# Altium schematic sheet MCU.SchDoc: MCU
size A3; ApprovedBy: LD Stanton; Author: LD Stanton; CompanyName: University of Cape Town; DrawnBy: Lawrence Stanton; Engineer: Lawrence Stanton; Organization: University of Cape Town; Address1: Department of Electrical Engineering; Address2: Rondebosch; Address3: Cape Town; Address4: South Africa 7701; DocumentNumber: 11; SheetNumber: 11; SheetTotal: 20
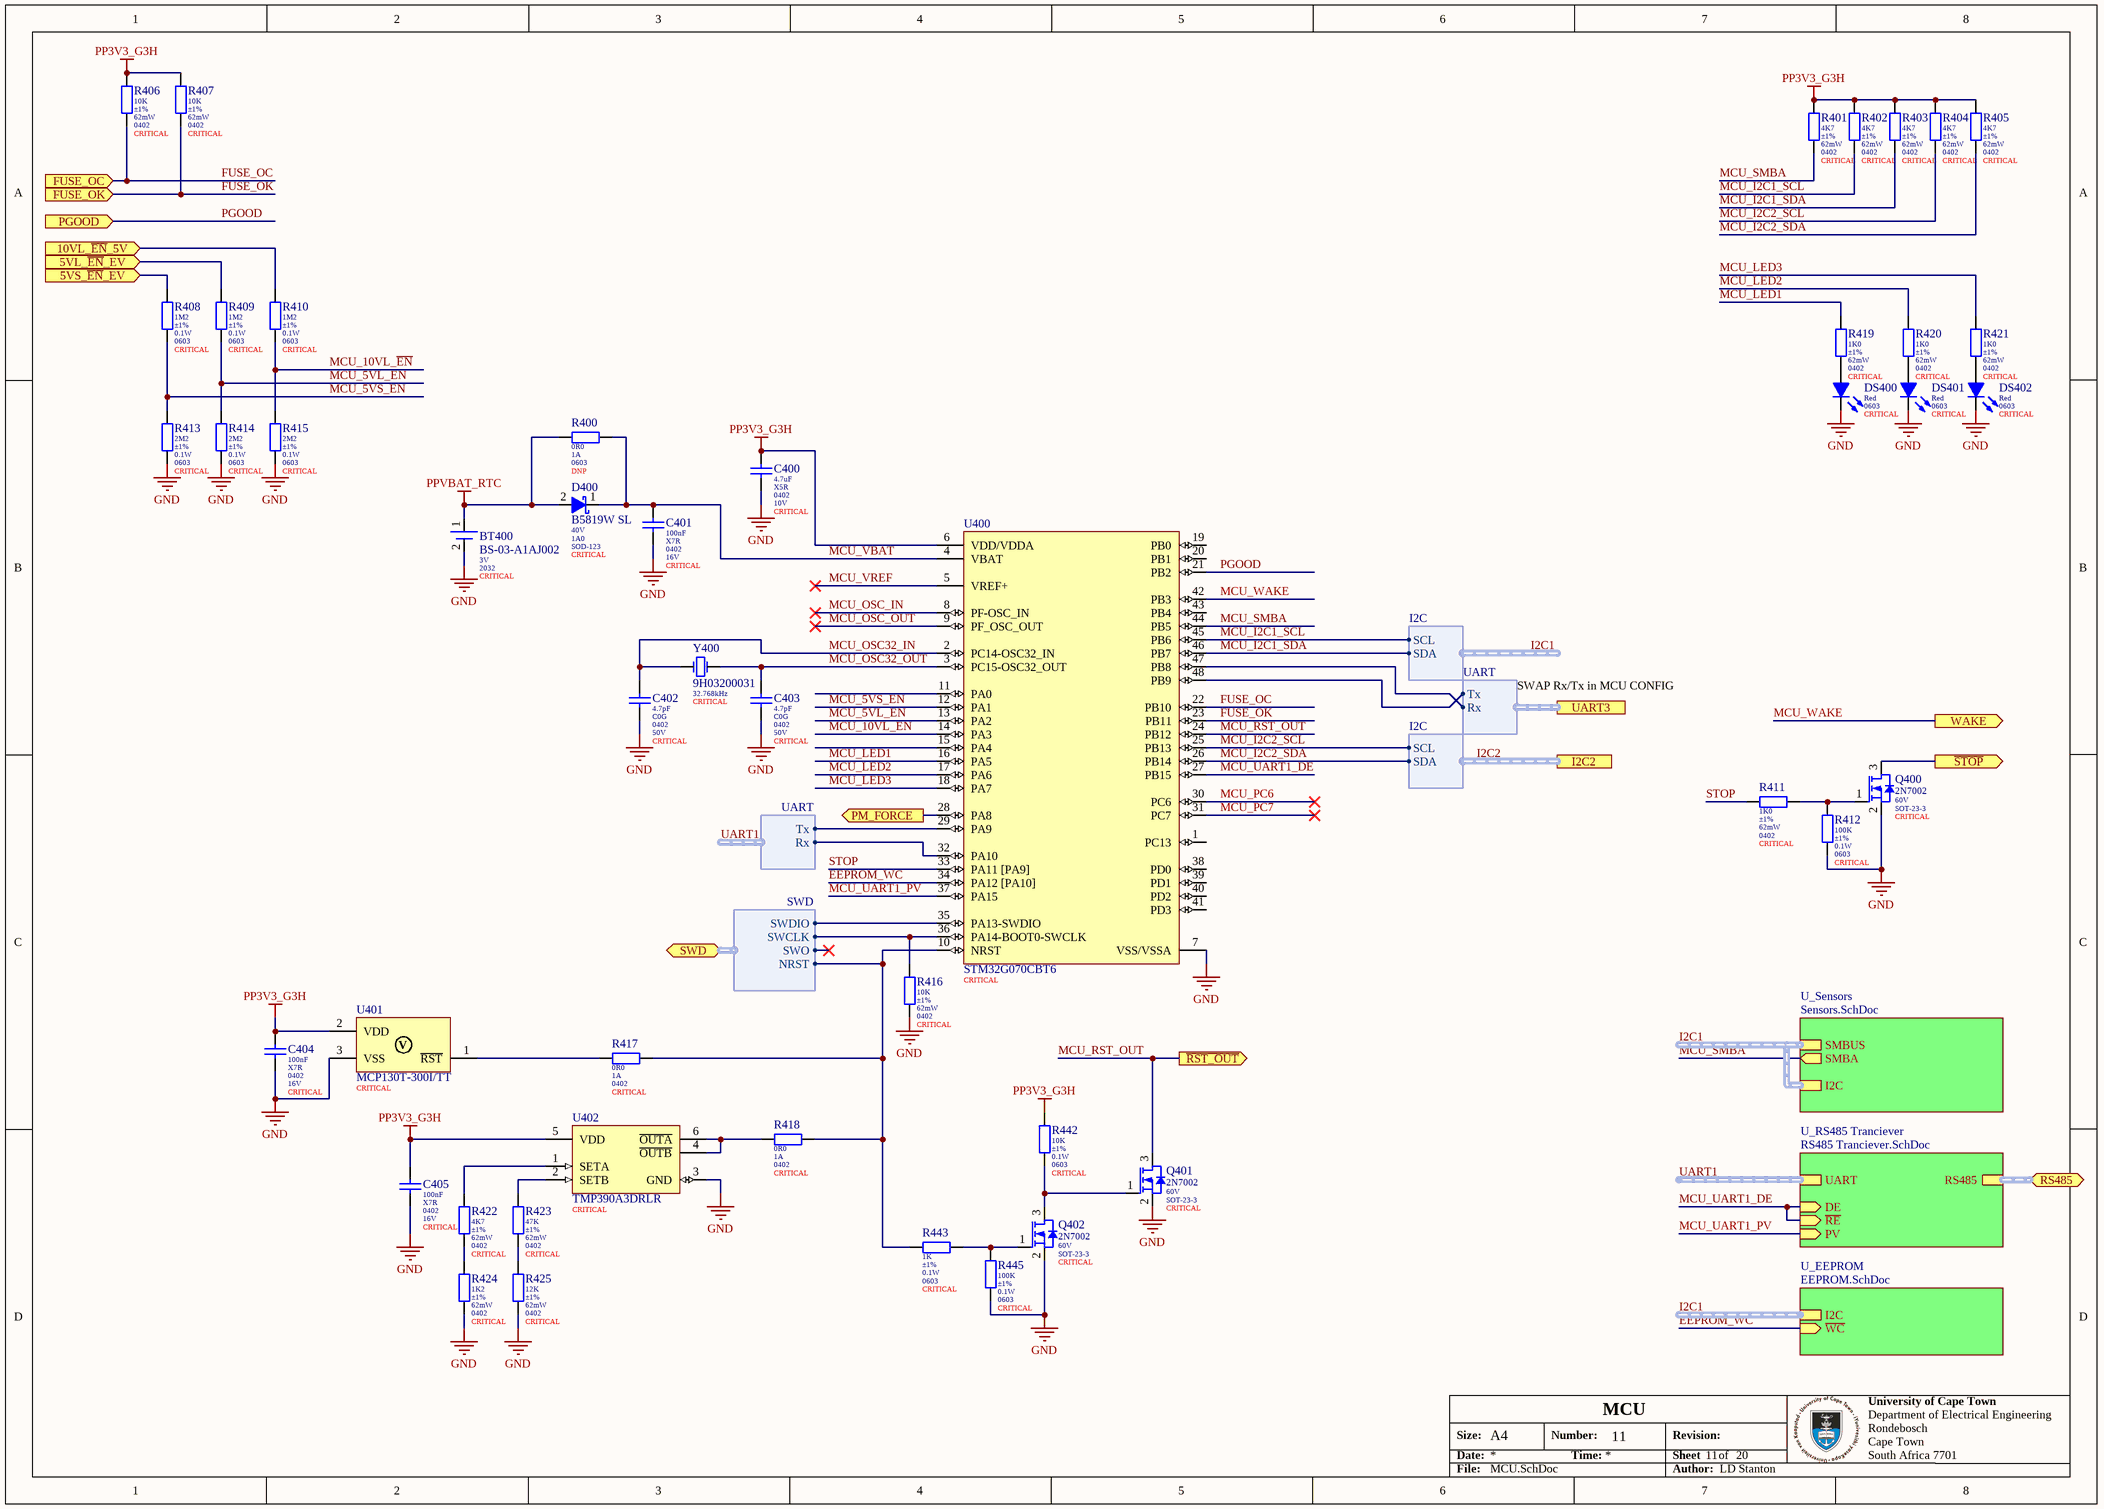
[diagram p0: MCU.SchDoc]

## Parts
BT400  BS-03-A1AJ002  value 3V  Package: 2032  Placement: CRITICAL  [BS-03-A1AJ002-Footprint-1]
C400  value 4.7uF  Dielectric: X5R  Package: 0402  Voltage: 10V  Populate: CRITICAL  [0402_050_5 (Samsumg) B]  (hidden comment: CL05A475MP5NRNC)
C401  value 100nF  Dielectric: X7R  Package: 0402  Voltage: 16V  Populate: CRITICAL  [0402_050_5 (Samsumg) B]  (hidden comment: CL05B104KO5NNNC)
C402  value 4.7pF  Dielectric: C0G  Package: 0402  Voltage: 50V  Populate: CRITICAL  [0402_050 (Guandong) B]  (hidden comment: 0402CG4R7C500NT)
C403  value 4.7pF  Dielectric: C0G  Package: 0402  Voltage: 50V  Populate: CRITICAL  [0402_050 (Guandong) B]  (hidden comment: 0402CG4R7C500NT)
C404  value 100nF  Dielectric: X7R  Package: 0402  Voltage: 16V  Populate: CRITICAL  [0402_050_5 (Samsumg) B]  (hidden comment: CL05B104KO5NNNC)
C405  value 100nF  Dielectric: X7R  Package: 0402  Voltage: 16V  Populate: CRITICAL  [0402_050_5 (Samsumg) B]  (hidden comment: CL05B104KO5NNNC)
D400  B5819W SL  Blocking Voltage: 40V  Forward Current: 1A0  Package: SOD-123  Placement: CRITICAL  [SOD-123 (JCET) B]
DS400  Colour: Red  Package: 0603  Placement: CRITICAL  [LED 0603 (Everlight) B]  (hidden comment: 19-217/R6C-AL1M2VY/3T)
DS401  Colour: Red  Package: 0603  Placement: CRITICAL  [LED 0603 (Everlight) B]  (hidden comment: 19-217/R6C-AL1M2VY/3T)
DS402  Colour: Red  Package: 0603  Placement: CRITICAL  [LED 0603 (Everlight) B]  (hidden comment: 19-217/R6C-AL1M2VY/3T)
Q400  2N7002  Maximum Drain Source Voltage: 60V  Package: SOT-23-3  Placement: CRITICAL  [SOT-23-3 (2N7002) B]
Q401  2N7002  Maximum Drain Source Voltage: 60V  Package: SOT-23-3  Placement: CRITICAL  [SOT-23-3 (2N7002) B]
Q402  2N7002  Maximum Drain Source Voltage: 60V  Package: SOT-23-3  Placement: CRITICAL  [SOT-23-3 (2N7002) B]
R400  value 0R0  Current: 1A  Package: 0603  Populate: DNP  [0603 (Uniroyal) B]  (hidden comment: 0603WAF0000T5E)
R401  value 4K7  Tolerance: ±1%  Power: 62mW  Package: 0402  Populate: CRITICAL  [0402 (Uniroyal) B]  (hidden comment: 0402WGF4701TCE)
R402  value 4K7  Tolerance: ±1%  Power: 62mW  Package: 0402  Populate: CRITICAL  [0402 (Uniroyal) B]  (hidden comment: 0402WGF4701TCE)
R403  value 4K7  Tolerance: ±1%  Power: 62mW  Package: 0402  Populate: CRITICAL  [0402 (Uniroyal) B]  (hidden comment: 0402WGF4701TCE)
R404  value 4K7  Tolerance: ±1%  Power: 62mW  Package: 0402  Populate: CRITICAL  [0402 (Uniroyal) B]  (hidden comment: 0402WGF4701TCE)
R405  value 4K7  Tolerance: ±1%  Power: 62mW  Package: 0402  Populate: CRITICAL  [0402 (Uniroyal) B]  (hidden comment: 0402WGF4701TCE)
R406  value 10K  Tolerance: ±1%  Power: 62mW  Package: 0402  Populate: CRITICAL  [0402 (Uniroyal) B]  (hidden comment: 0402WGF1002TCE)
R407  value 10K  Tolerance: ±1%  Power: 62mW  Package: 0402  Populate: CRITICAL  [0402 (Uniroyal) B]  (hidden comment: 0402WGF1002TCE)
R408  value 1M2  Tolerance: ±1%  Power: 0.1W  Package: 0603  Populate: CRITICAL  [0603 (Uniroyal) B]  (hidden comment: 0603WAF1204T5E)
R409  value 1M2  Tolerance: ±1%  Power: 0.1W  Package: 0603  Populate: CRITICAL  [0603 (Uniroyal) B]  (hidden comment: 0603WAF1204T5E)
R410  value 1M2  Tolerance: ±1%  Power: 0.1W  Package: 0603  Populate: CRITICAL  [0603 (Uniroyal) B]  (hidden comment: 0603WAF1204T5E)
R411  value 1K0  Tolerance: ±1%  Power: 62mW  Package: 0402  Populate: CRITICAL  [0402 (Uniroyal) B]  (hidden comment: 0402WGF1001TCE)
R412  value 100K  Tolerance: ±1%  Power: 0.1W  Package: 0603  Populate: CRITICAL  [0603 (Uniroyal) B]  (hidden comment: 0603WAF1003T5E)
R413  value 2M2  Tolerance: ±1%  Power: 0.1W  Package: 0603  Populate: CRITICAL  [0603 (Uniroyal) B]  (hidden comment: 0603WAF2204T5E)
R414  value 2M2  Tolerance: ±1%  Power: 0.1W  Package: 0603  Populate: CRITICAL  [0603 (Uniroyal) B]  (hidden comment: 0603WAF2204T5E)
R415  value 2M2  Tolerance: ±1%  Power: 0.1W  Package: 0603  Populate: CRITICAL  [0603 (Uniroyal) B]  (hidden comment: 0603WAF2204T5E)
R416  value 10K  Tolerance: ±1%  Power: 62mW  Package: 0402  Populate: CRITICAL  [0402 (Uniroyal) B]  (hidden comment: 0402WGF1002TCE)
R417  value 0R0  Current: 1A  Package: 0402  Populate: CRITICAL  [0402 (Uniroyal) B]  (hidden comment: 0402WGF0000TCE)
R418  value 0R0  Current: 1A  Package: 0402  Populate: CRITICAL  [0402 (Uniroyal) B]  (hidden comment: 0402WGF0000TCE)
R419  value 1K0  Tolerance: ±1%  Power: 62mW  Package: 0402  Populate: CRITICAL  [0402 (Uniroyal) B]  (hidden comment: 0402WGF1001TCE)
R420  value 1K0  Tolerance: ±1%  Power: 62mW  Package: 0402  Populate: CRITICAL  [0402 (Uniroyal) B]  (hidden comment: 0402WGF1001TCE)
R421  value 1K0  Tolerance: ±1%  Power: 62mW  Package: 0402  Populate: CRITICAL  [0402 (Uniroyal) B]  (hidden comment: 0402WGF1001TCE)
R422  value 4K7  Tolerance: ±1%  Power: 62mW  Package: 0402  Populate: CRITICAL  [0402 (Uniroyal) B]  (hidden comment: 0402WGF4701TCE)
R423  value 47K  Tolerance: ±1%  Power: 62mW  Package: 0402  Populate: CRITICAL  [0402 (Uniroyal) B]  (hidden comment: 0402WGF4702TCE)
R424  value 1K2  Tolerance: ±1%  Power: 62mW  Package: 0402  Populate: CRITICAL  [0402 (Uniroyal) B]  (hidden comment: 0402WGF1201TCE)
R425  value 12K  Tolerance: ±1%  Power: 62mW  Package: 0402  Populate: CRITICAL  [0402 (Uniroyal) B]  (hidden comment: 0402WGF1202TCE)
R442  value 10K  Tolerance: ±1%  Power: 0.1W  Package: 0603  Populate: CRITICAL  [0603 (Uniroyal) B]  (hidden comment: 0603WAF1002T5E)
R443  value 1K  Tolerance: ±1%  Power: 0.1W  Package: 0603  Populate: CRITICAL  [0603 (Uniroyal) B]  (hidden comment: 0603WAF1001T5E)
R445  value 100K  Tolerance: ±1%  Power: 0.1W  Package: 0603  Populate: CRITICAL  [0603 (Uniroyal) B]  (hidden comment: 0603WAF1003T5E)
U400  STM32G070CBT6  Placement: CRITICAL  [LQFP48 (STM32G0) B]
U401  MCP130T-300I/TT  Placement: CRITICAL  [SOT23-3 (MCP120) B]
U402  TMP390A3DRLR  Placement: CRITICAL  [SOT56-3 (DRL0006A) B]
Y400  9H03200031  Frequency: 32.768kHz  Placement: CRITICAL  [Crystal 3215 (TXC) B]

## Sub-sheets
U_EEPROM = EEPROM.SchDoc: I2C (harness I2C), ~{WC} (in)
U_RS485 Tranciever = RS485 Tranciever.SchDoc: RS485 (harness RS485), UART (harness UART), DE (in), ~{RE} (in), PV (in)
U_Sensors = Sensors.SchDoc: SMBUS (harness I2C), SMBA (out), I2C (harness I2C)

## Ports
5VL_~{EN}_EV (in), 5VS_~{EN}_EV (in), 10VL_~{EN}_5V (in), FUSE_OC (in), FUSE_OK (in), I2C2 (harness I2C), PGOOD (in), PM_FORCE (out), RS485 (bidir, harness RS485), SWD (bidir, harness SWD), UART3 (harness UART), WAKE (out), ~{RST_OUT} (out), ~{STOP} (out)

## Harnesses
I2C: SCL, SDA
SWD: SWCLK, SWDIO, NRST, SWO
UART: Rx, Tx

## Nets
GND: BT400.2 C400.2 C401.2 C402.2 C403.2 C404.2 C405.2 DS400.K DS401.K DS402.K Q400.2(S) Q401.2(S) Q402.2(S) R412.2 R413.2 R414.2 R415.2 R416.2 R424.2 R425.2 R445.2 U400.7(VSS/VSSA) U401.3(VSS) U402.3(GND)
PP3V3_G3H: C400.1 C404.1 C405.1 R401.1 R402.1 R403.1 R404.1 R405.1 R406.1 R407.1 R442.1 U400.6(VDD/VDDA) U401.2(VDD) U402.5(VDD)
PPVBAT_RTC: BT400.1 D400.2(A) R400.1
5VL_~{EN}_EV: R409.2 ; port 5VL_~{EN}_EV
5VS_~{EN}_EV: R408.2 ; port 5VS_~{EN}_EV
10VL_~{EN}_5V: R410.2 ; port 10VL_~{EN}_5V
~{EEPROM_WC}: U400.34(PA12_[PA10]) ; sheet U_EEPROM/~{WC}
~{STOP}: Q400.3(D) ; port ~{STOP}
FUSE_OC: R406.2 U400.22(PB10) ; port FUSE_OC
FUSE_OK: R407.2 U400.23(PB11) ; port FUSE_OK
MCU_5VL_~{EN}: R409.1 R414.1 U400.13(PA2)
MCU_5VS_~{EN}: R408.1 R413.1 U400.12(PA1)
MCU_10VL_~{EN}: R410.1 R415.1 U400.14(PA3)
MCU_I2C1_SCL: R402.2 U400.45(PB6) ; sheet U_EEPROM/I2C.SCL  [project net I2C1.SCL]
MCU_I2C1_SDA: R403.2 U400.46(PB7) ; sheet U_EEPROM/I2C.SDA  [project net I2C1.SDA]
MCU_I2C2_SCL: R404.2 U400.25(PB13) ; port I2C2.SCL  [project net I2C2.SCL]
MCU_I2C2_SDA: R405.2 U400.26(PB14) ; port I2C2.SDA  [project net I2C2.SDA]
MCU_LED1: R419.1 U400.16(PA5)
MCU_LED2: R420.1 U400.17(PA6)
MCU_LED3: R421.1 U400.18(PA7)
MCU_OSC32_IN: C402.1 U400.2(PC14-OSC32_IN) Y400.1
MCU_OSC32_OUT: C403.1 U400.3(PC15-OSC32_OUT) Y400.2
MCU_OSC_IN: U400.8(PF-OSC_IN)
MCU_OSC_OUT: U400.9(PF_OSC_OUT)
MCU_PC6: U400.30(PC6)
MCU_PC7: U400.31(PC7)
MCU_RST_OUT: Q401.3(D) U400.24(PB12) ; port ~{RST_OUT}
MCU_SMBA: R401.2 U400.44(PB5) ; sheet U_Sensors/SMBA
MCU_UART1_DE: U400.27(PB15) ; sheet U_RS485 Tranciever/DE, sheet U_RS485 Tranciever/~{RE}
MCU_UART1_PV: U400.37(PA15) ; sheet U_RS485 Tranciever/PV
MCU_VBAT: C401.1 D400.1(K) R400.2 U400.4(VBAT)
MCU_VREF: U400.5(VREF+)
MCU_WAKE: U400.42(PB3) ; port WAKE
PGOOD: U400.21(PB2) ; port PGOOD
PM_FORCE: U400.28(PA8) ; port PM_FORCE
STOP: R411.1 U400.33(PA11_[PA9])
UART1.Rx: U400.32(PA10) ; sheet U_RS485 Tranciever/UART.Rx
UART1.Tx: U400.29(PA9) ; sheet U_RS485 Tranciever/UART.Tx
NetDS400_A: DS400.A R419.2
NetDS401_A: DS401.A R420.2
NetDS402_A: DS402.A R421.2
NetQ400_1: Q400.1(G) R411.2 R412.1
NetQ401_1: Q401.1(G) Q402.3(D) R442.2
NetQ402_1: Q402.1(G) R443.2 R445.1
NetR416_1: R416.1 U400.36(PA14-BOOT0-SWCLK) ; port SWD.SWCLK
NetR417_1: R417.1 U401.1(~{RST})
NetR417_2: R417.2 R418.2 R443.1 U400.10(NRST) ; port SWD.NRST
NetR418_1: R418.1 U402.4(~{OUTB}) U402.6(~{OUTA})
NetR422_1: R422.1 U402.1(SETA)
NetR422_2: R422.2 R424.1
NetR423_1: R423.1 U402.2(SETB)
NetR423_2: R423.2 R425.1
NetU400_35: U400.35(PA13-SWDIO) ; port SWD.SWDIO
NetU400_47: U400.47(PB8) ; port UART3.Rx
NetU400_48: U400.48(PB9) ; port UART3.Tx

Not connected (* = marked no-connect by the designer): U400 1(PC13) 11(PA0) 15(PA4) 19(PB0) 20(PB1) 38(PD0) 39(PD1) 40(PD2) 41(PD3) 43(PB4)

## Buses and harness runs
harness I2C1 = sheet U_EEPROM/I2C
harness I2C1 = sheet U_Sensors/I2C = sheet U_Sensors/SMBUS
harness I2C2 = port I2C2
harness port RS485 = sheet U_RS485 Tranciever/RS485
harness UART1 = sheet U_RS485 Tranciever/UART

## Notes on the sheet
- SWAP Rx/Tx in MCU CONFIG
- Size:
- Date:
- A4
- Number:
- Time:
- Revision:
- Sheet
- of
- File:
- Author:
- (in symbol CMP-000036-4) V

## Library data of the parts
BT400 = CMP-002-00001-3: Coin Cell Battery Holder 2032; LCSC Part Number: C964748; ComponentLink1Description: Drawing; ComponentLink1URL: https://datasheet.lcsc.com/lcsc/2012181808_MYOUNG-BS-03-A1AJ002_C964748.pdf
C400 = CMP-045-000019-8: MLCC 4.7uF 0402 10V X5R ±20%; Manufacturer: Samsung; ComponentLink1URL: https://datasheet.lcsc.com/szlcsc/Samsung-Electro-Mechanics-CL05C100JB5NNNC_C32949.pdf; Tolerance: ±20%; LCSC Part Number: C23733; ComponentLink1Description: Datasheet
C401 C404 C405 = CMP-045-000014-12: MLCC 100nF 0402 16V X7R ±10%; Manufacturer: Samsung; ComponentLink1Description: Datasheet; ComponentLink1URL: https://datasheet.lcsc.com/szlcsc/Samsung-Electro-Mechanics-CL05C100JB5NNNC_C32949.pdf; LCSC Part Number: C1525; Tolerance: ±10%
C402 C403 = CMP-014-000013-1: MLCC 4.7pF 0402 50V C0G ±0.25pF; Manufacturer: Guandong; ComponentLink1URL: https://datasheet.lcsc.com/szlcsc/Guangdong-Fenghua-Advanced-Tech-0402B102K500NT_C1523.pdf; ComponentLink1Description: Datasheet; LCSC Part Number: C1569; Tolerance: ±0.25pF
D400 = CMP-022-000009-2: Schottky Barrier Diode 40V 1A 600mV SOD-123 JCET; ComponentLink1URL: https://datasheet.lcsc.com/lcsc/1809140216_Changjiang-Electronics-Tech--CJ-B5819W-SL_C8598.pdf; LCSC Part Number: C8598; ComponentLink1Description: Datasheet
DS400-DS402 = CMP-007-00000-1: LED 0603 SMT Red; Manufacturer: Everlight; Maximum Forward Current: 20mA; Forward Voltage: 2.2V; ComponentLink1Description: Datasheet; RoHS Compliant: Yes; ComponentLink1URL: https://datasheet.lcsc.com/lcsc/1811101510_Everlight-Elec-19-217-R6C-AL1M2VY-3T_C72044.pdf; LCSC Part Number: C72044
Q400-Q402 = CMP-040-000000-14: Small Signal MOSFET, 500 mA, 60 V, N-Channel, Enhancement, JCET SOT-23-3; Gate Threshold Voltage: 2V5; Power: 0.225W; Maximum Drain Current: 0.2A; Maximum Gate Source Voltage: ±20V; Drain-Source On Resistance: 7R; ComponentLink1Description: Datasheet; LCSC Part Number: C8545; ComponentLink1URL: https://datasheet.lcsc.com/szlcsc/Changjiang-Electronics-Tech-CJ-2N7002_C8545.pdf; Manufacturer: JCET
R400 = CMP-010-000359-7: Jumper 0603 1A Uniroyal; Pin Count: 2; ComponentLink1URL: https://datasheet.lcsc.com/szlcsc/1811062009_UNI-ROYAL-Uniroyal-Elec-0603WAF1002T5E_C25804.pdf; Manufacturer: Uniroyal; LCSC Part Number: C21189; Temperature: -55 - 155°C; ComponentLink1Description: Datasheet
R401-R405 R422 = CMP-010-000338-12: Resistor 4K7 0402 ±1% Thick Film Uniroyal; Temperature Coefficient: ±100ppm/K; Working Voltage: 50V; Temperature: -55 - 155°C; ComponentLink1URL: https://datasheet.lcsc.com/szlcsc/1811062009_UNI-ROYAL-Uniroyal-Elec-0603WAF1002T5E_C25804.pdf; Manufacturer: Uniroyal; LCSC Part Number: C25900; Pin Count: 2; ComponentLink1Description: Datasheet
R406 R407 R416 = CMP-010-000292-12: Resistor 10K 0402 ±1% Thick Film Uniroyal; Working Voltage: 50V; Temperature Coefficient: ±100ppm/K; Manufacturer: Uniroyal; Pin Count: 2; ComponentLink1URL: https://datasheet.lcsc.com/szlcsc/1811062009_UNI-ROYAL-Uniroyal-Elec-0603WAF1002T5E_C25804.pdf; LCSC Part Number: C25744; Temperature: -55 - 155°C; ComponentLink1Description: Datasheet
R408-R410 = CMP-010-000374-4: Resistor 1M2 0603 ±1% Thick Film Uniroyal; Temperature Coefficient: ±100ppm/K; Working Voltage: 75V; Temperature: -55 - 155°C; Pin Count: 2; ComponentLink1URL: https://datasheet.lcsc.com/szlcsc/1811062009_UNI-ROYAL-Uniroyal-Elec-0603WAF1002T5E_C25804.pdf; Manufacturer: Uniroyal; LCSC Part Number: C13315; ComponentLink1Description: Datasheet
R411 R419-R421 = CMP-010-000307-13: Resistor 1K0 0402 ±1% Thick Film Uniroyal; Working Voltage: 50V; Temperature Coefficient: ±100ppm/K; Temperature: -55 - 155°C; ComponentLink1URL: https://datasheet.lcsc.com/szlcsc/1811062009_UNI-ROYAL-Uniroyal-Elec-0603WAF1002T5E_C25804.pdf; Manufacturer: Uniroyal; Pin Count: 2; ComponentLink1Description: Datasheet; LCSC Part Number: C11702
R412 R445 = CMP-010-000288-10: Resistor 100K 0603 ±1% Thick Film Uniroyal; Working Voltage: 75V; Temperature Coefficient: ±100ppm/K; Manufacturer: Uniroyal; ComponentLink1URL: https://datasheet.lcsc.com/szlcsc/1811062009_UNI-ROYAL-Uniroyal-Elec-0603WAF1002T5E_C25804.pdf; LCSC Part Number: C25803; Temperature: -55 - 155°C; ComponentLink1Description: Datasheet; Pin Count: 2
R413-R415 = CMP-010-000383-2: Resistor 2M2 0603 ±1% Thick Film Uniroyal; Temperature Coefficient: ±100ppm/K; Working Voltage: 75V; Temperature: -55 - 155°C; Manufacturer: Uniroyal; Pin Count: 2; LCSC Part Number: C22938; ComponentLink1URL: https://datasheet.lcsc.com/szlcsc/1811062009_UNI-ROYAL-Uniroyal-Elec-0603WAF1002T5E_C25804.pdf; ComponentLink1Description: Datasheet
R417 R418 = CMP-010-000280-15: Jumper 0402 1A Uniroyal; Working Voltage: 50V; ComponentLink1URL: https://datasheet.lcsc.com/szlcsc/1811062009_UNI-ROYAL-Uniroyal-Elec-0603WAF1002T5E_C25804.pdf; Manufacturer: Uniroyal; ComponentLink1Description: Datasheet; LCSC Part Number: C17168; Pin Count: 2; Temperature: -55 - 155°C
R423 = CMP-010-000337-13: Resistor 47K 0402 ±1% Thick Film Uniroyal; Temperature Coefficient: ±100ppm/K; Working Voltage: 50V; Temperature: -55 - 155°C; ComponentLink1Description: Datasheet; Pin Count: 2; Manufacturer: Uniroyal; ComponentLink1URL: https://datasheet.lcsc.com/szlcsc/1811062009_UNI-ROYAL-Uniroyal-Elec-0603WAF1002T5E_C25804.pdf; LCSC Part Number: C25792
R424 = CMP-010-000309-12: Resistor 1K2 0402 ±1% Thick Film Uniroyal; Temperature Coefficient: ±100ppm/K; Working Voltage: 50V; ComponentLink1Description: Datasheet; LCSC Part Number: C25862; ComponentLink1URL: https://datasheet.lcsc.com/szlcsc/1811062009_UNI-ROYAL-Uniroyal-Elec-0603WAF1002T5E_C25804.pdf; Temperature: -55 - 155°C; Pin Count: 2; Manufacturer: Uniroyal
R425 = CMP-010-000301-12: Resistor 12K 0402 ±1% Thick Film Uniroyal; Temperature Coefficient: ±100ppm/K; Working Voltage: 50V; ComponentLink1URL: https://datasheet.lcsc.com/szlcsc/1811062009_UNI-ROYAL-Uniroyal-Elec-0603WAF1002T5E_C25804.pdf; LCSC Part Number: C25752; Pin Count: 2; Manufacturer: Uniroyal; ComponentLink1Description: Datasheet; Temperature: -55 - 155°C
R442 = CMP-010-000293-9: Resistor 10K 0603 ±1% Thick Film Uniroyal; Temperature Coefficient: ±100ppm/K; Working Voltage: 75V; Manufacturer: Uniroyal; LCSC Part Number: C25804; ComponentLink1URL: https://datasheet.lcsc.com/szlcsc/1811062009_UNI-ROYAL-Uniroyal-Elec-0603WAF1002T5E_C25804.pdf; Pin Count: 2; Temperature: -55 - 155°C; ComponentLink1Description: Datasheet
R443 = CMP-010-000308-11: Resistor 1K0 0603 ±1% Thick Film Uniroyal; Working Voltage: 75V; Temperature Coefficient: ±100ppm/K; ComponentLink1URL: https://datasheet.lcsc.com/szlcsc/1811062009_UNI-ROYAL-Uniroyal-Elec-0603WAF1002T5E_C25804.pdf; LCSC Part Number: C21190; Pin Count: 2; Manufacturer: Uniroyal; ComponentLink1Description: Datasheet; Temperature: -55 - 155°C
U400 = CMP-051-000054-5: STM32G Series 128kB Flash 36kB RAM LQFP-48; LCSC Part Number: C529338; RoHS: Yes; ComponentLink1Description: Product Page; ComponentLink3Description: Hardware Development; ComponentLink2URL: https://www.st.com/resource/en/datasheet/stm32g070cb.pdf; ComponentLink1URL: https://www.st.com/en/microcontrollers-microprocessors/stm32g0x0-value-line.html; ComponentLink3URL: https://www.st.com/resource/en/application_note/dm00443870-getting-started-with-stm32g0-series-hardware-development-stmicroelectronics.pdf; ComponentLink2Description: Datasheet
U401 = CMP-000036-4: Voltage Supervisor 45 uA 3V3 SOT23-3; Min Reset Threshold Voltage: 2.85V; Min Supply Voltage: 1V; Max Supply Voltage: 5.5V; Max Supply Current: 60uA; Accuracy: -5%; Quiescent Current: 45uA; Max Reset Threshold Voltage: 3V; Height: 0.95mm; RoHS Compliant: Yes; Case/Package: SOT-23; Min Operating Temperature: -40°C; ComponentLink1URL: https://ww1.microchip.com/downloads/en/DeviceDoc/11184d.pdf; Max Operating Temperature: 85°C; ComponentLink1Description: Datasheet; LCSC Part Number: C410526; Package Quantity: 1
U402 = CMP-061-000002-1: Temperature Switch Open Drain Hot & Cold 0.5-µA Resistor Programmable SOT56-3 -55 to 130C; Manufacturer: Texas Instruments; Package: SOT56-3; ComponentLink1URL: https://www.ti.com/lit/ds/symlink/tmp390.pdf?HQS=dis-dk-null-digikeymode-dsf-pf-null-wwe&ts=1631180560126&ref_url=https%253A%252F%252Fwww.ti.com%252Fgeneral%252Fdocs%252Fsuppproductinfo.tsp%253FdistId%253D10%2526gotoUrl%253Dhttps%253A%252F%252Fwww.ti.com%252Flit%252Fgpn%252Ftmp390; ComponentLink1Description: Datasheet
Y400 = CMP-003-00000-3: Crystal 32.768KHZ 12.5PF SMD; Frequency Tolerance: ±20ppm; Load Capacitance: 12.5pF; Min Operating Temperature: -40°C; Max Operating Temperature: 85°C; Package: 3215; ComponentLink1Description: Datasheet; ComponentLink1URL: http://www.txccorp.com/download/products/quartz_crystals/2015TXC_9HT10_31.pdf